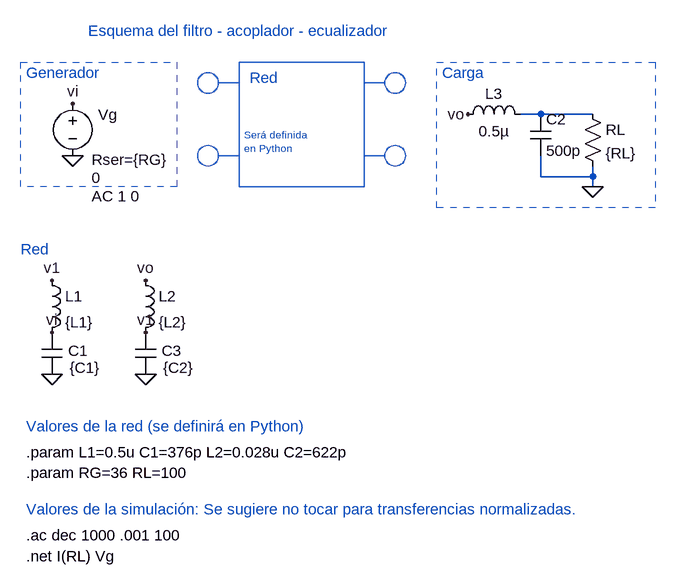
[diagram p0: schematic spar broadband.asc]
spar broadband.asc, the LTspice schematic file:
Version 4
SHEET 1 932 680
WIRE 752 -256 720 -256
WIRE 832 -256 752 -256
WIRE 752 -160 752 -192
WIRE 832 -160 832 -176
WIRE 832 -160 752 -160
WIRE 832 -144 832 -160
FLAG 32 -192 0
FLAG 0 144 0
FLAG 832 -144 0
FLAG 32 -272 vi
FLAG 640 -256 vo
FLAG 0 80 vi
FLAG 0 0 v1
FLAG 144 144 0
FLAG 144 80 v1
FLAG 144 0 vo
SYMBOL voltage 32 -288 R0
WINDOW 3 29 130 Left 2
WINDOW 123 29 158 Left 2
WINDOW 39 29 102 Left 2
WINDOW 0 39 33 Left 2
SYMATTR Value 0
SYMATTR Value2 AC 1 0
SYMATTR SpiceLine Rser={RG}
SYMATTR InstName Vg
SYMBOL res 816 -272 R0
SYMATTR InstName RL
SYMATTR Value {RL}
SYMBOL ind -16 -16 R0
SYMATTR InstName L1
SYMATTR Value {L1}
SYMBOL cap -16 80 R0
WINDOW 0 41 28 Left 2
WINDOW 3 43 54 Left 2
SYMATTR InstName C1
SYMATTR Value {C1}
SYMBOL cap 736 -256 R0
SYMATTR InstName C2
SYMATTR Value 500p
SYMBOL ind 624 -240 R270
WINDOW 0 32 56 VTop 2
WINDOW 3 5 56 VBottom 2
SYMATTR InstName L3
SYMATTR Value 0.5µ
SYMBOL ind 128 -16 R0
SYMATTR InstName L2
SYMATTR Value {L2}
SYMBOL cap 128 80 R0
WINDOW 0 41 28 Left 2
WINDOW 3 43 54 Left 2
SYMATTR InstName C3
SYMATTR Value {C2}
TEXT -40 424 Left 2 !.net I(RL) Vg
TEXT -40 392 Left 2 !.ac dec 1000 .001 100
TEXT 304 -312 Left 2 ;Red
TEXT -40 -320 Left 2 ;Generador
TEXT 600 -320 Left 2 ;Carga
TEXT 296 -224 Left 1 ;Será definida \nen Python
TEXT -40 224 Left 2 ;Valores de la red (se definirá en Python)
TEXT -40 296 Left 2 !.param RG=36 RL=100
TEXT -40 264 Left 2 !.param L1=0.5u C1=376p L2=0.028u C2=622p
TEXT 56 -384 Left 2 ;Esquema del filtro - acoplador - ecualizador
TEXT -40 352 Left 2 ;Valores de la simulación: Se sugiere no tocar para transferencias normalizadas.
TEXT -48 -48 Left 2 ;Red
LINE Normal 288 -304 256 -304
LINE Normal 288 -192 256 -192
LINE Normal 480 -192 512 -192
LINE Normal 480 -304 512 -304
RECTANGLE Normal 480 -144 288 -336
RECTANGLE Normal 192 -144 -48 -336 2
RECTANGLE Normal 928 -112 592 -336 2
CIRCLE Normal 256 -288 224 -320
CIRCLE Normal 256 -176 224 -208
CIRCLE Normal 512 -208 544 -176
CIRCLE Normal 512 -320 544 -288

The netlist it stands for:
* spar broadband.asc
Vg vi 0 0 AC 1 0 Rser={RG}
RL N001 0 {RL}
L1 v1 vi {L1}
C1 vi 0 {C1}
C2 N001 0 500p
L3 vo N001 0.5µ
L2 vo v1 {L2}
C3 v1 0 {C2}
.net I(RL) Vg
.ac dec 1000 .001 100
* Red
* Generador
* Carga
* Será definida
* en Python
* Valores de la red (se definirá en Python)
.param RG=36 RL=100
.param L1=0.5u C1=376p L2=0.028u C2=622p
* Esquema del filtro - acoplador - ecualizador
* Valores de la simulación: Se sugiere no tocar para transferencias normalizadas.
* Red
.backanno
.end